# EAGLE design Module_T+H_02v (EAGLE 7.7.0)
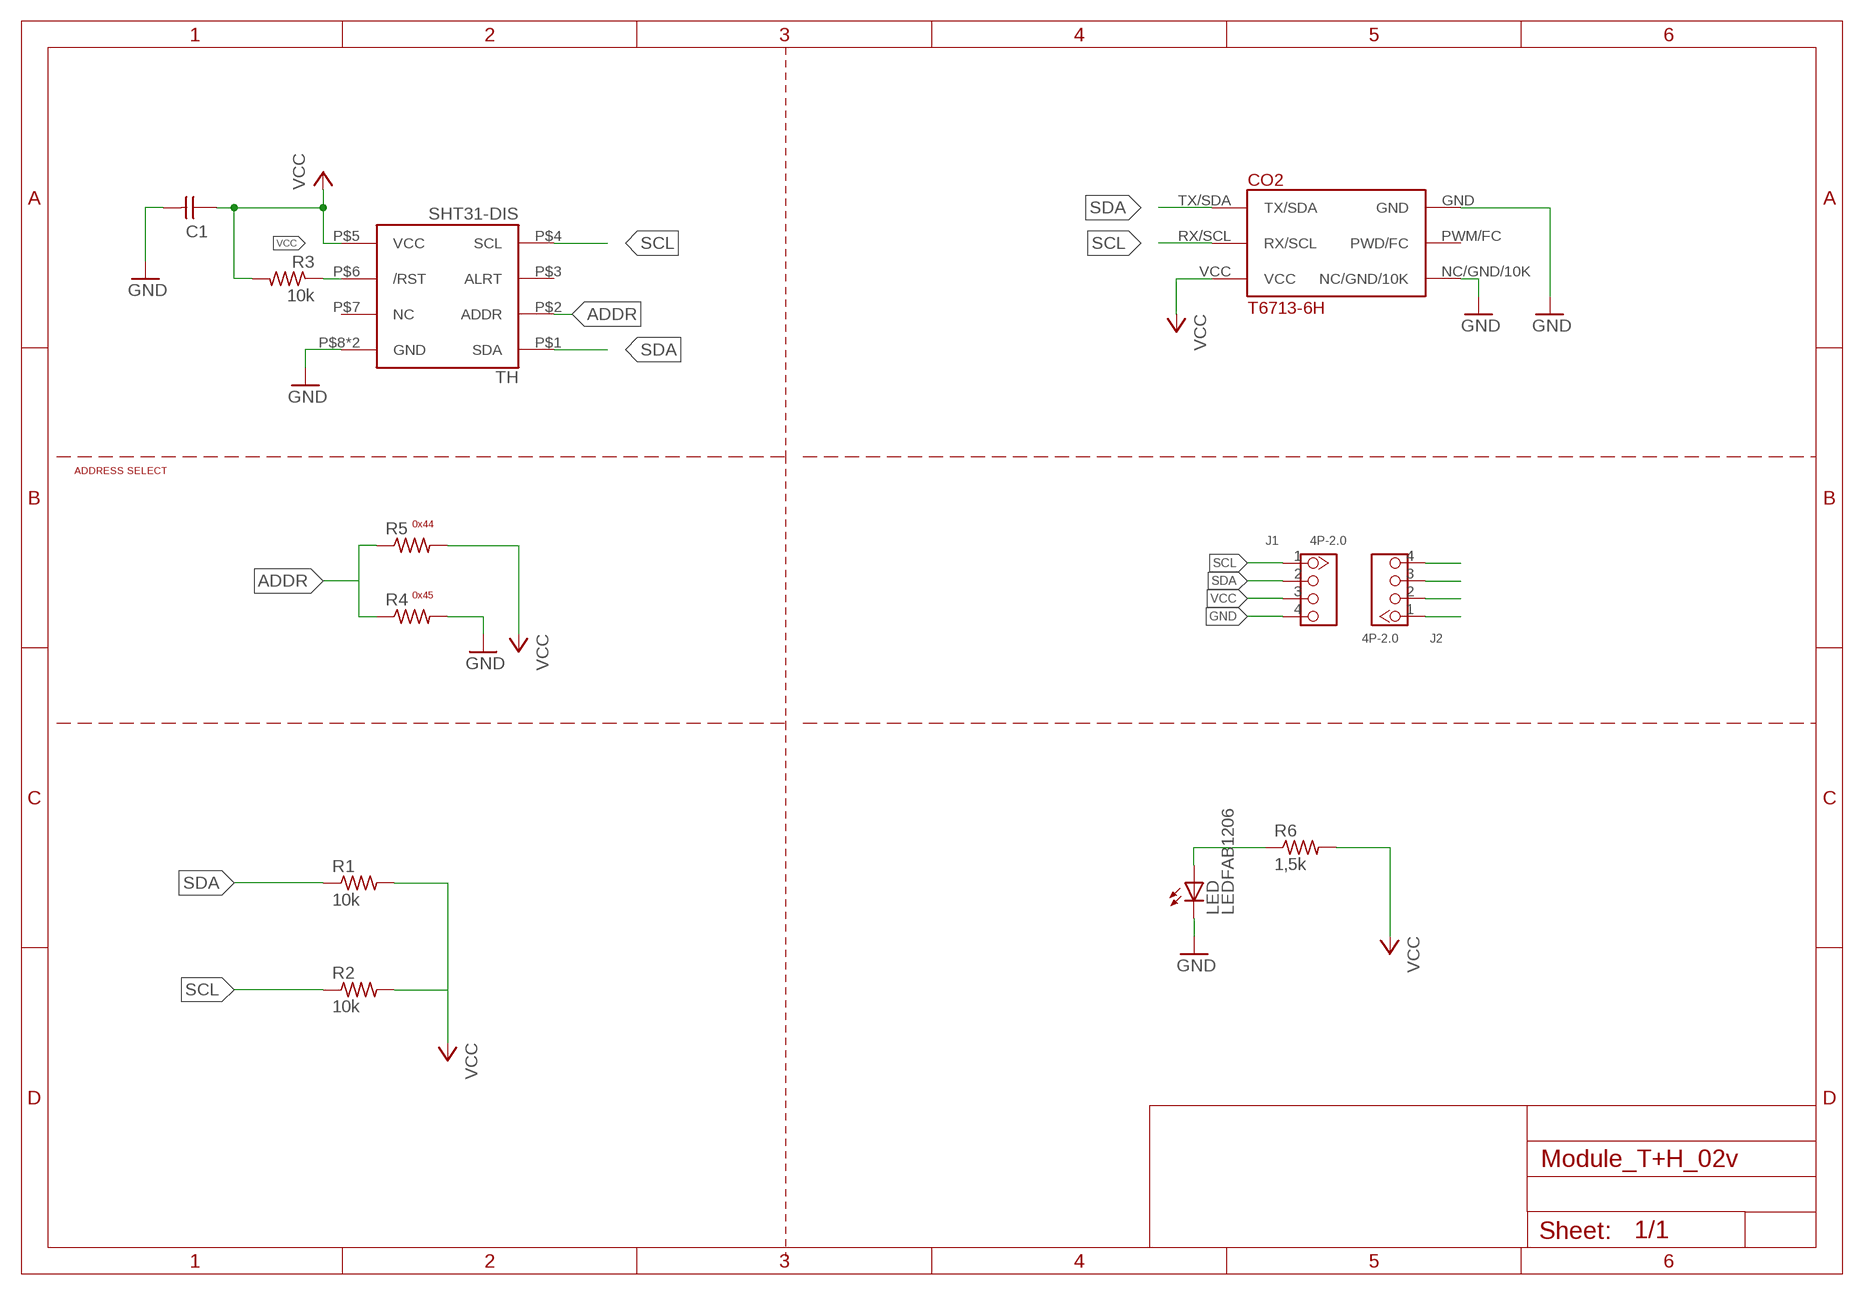
[diagram p0: schematic, sheet 1]

## Parts
C1  CAP-UNPOLARIZEDFAB  [C1206FAB]
CO2  T6713-6H  [PINS]
J1  4P-2.0  GROVE-CONNECTOR-DIP(4P-2.0)  [HW4-2.0]
J2  4P-2.0  GROVE-CONNECTOR-DIP(4P-2.0)  [HW4-2.0]
LED  LEDFAB1206  [LED1206FAB]
R1  10k  RES-US1206FAB  [R1206FAB]
R2  10k  RES-US1206FAB  [R1206FAB]
R3  10k  RES-US1206FAB  [R1206FAB]
R4  RES-US1206FAB  [R1206FAB]
R5  RES-US1206FAB  [R1206FAB]
R6  1,5k  RES-US1206FAB  [R1206FAB]
TH  SHT31-DIS  [SHT3X]

## Nets
ADDR: R4.1 R5.1 TH.P$2(ADDR)
GND: C1.2 CO2.GND CO2.NC/GND/10K J1.4 LED.2(C) R4.2 TH.P$8(GND) TH.PAD(GND)
N$1: LED.1(A) R6.1
N$10: J2.4
N$11: J2.3
N$12: J2.2
N$13: J2.1
RST: R3.1 TH.P$6(/RST)
SCL: CO2.RX/SCL J1.1 R2.1 TH.P$4(SCL)
SDA: CO2.TX/SDA J1.2 R1.1 TH.P$1(SDA)
VCC: C1.1 CO2.VCC J1.3 R1.2 R2.2 R3.2 R5.2 R6.2 TH.P$5(VCC)
Unconnected: CO2.PWM/FC(PWD/FC) TH.P$3(ALRT) TH.P$7(NC)

## Notes on the sheet
- ADDRESS SELECT
- 0x44
- 0x45

## Library data of the parts
C1 = fab_2:CAP-UNPOLARIZED
CO2 = T6713-6H:T6713-6H
J1 J2 = Seeed-OPL-Connector:GROVE-CONNECTOR-DIP(4P-2.0): 320110033
LED = fab_2:LED: LED
R1-R6 = fab:RES-US: Resistor (US Symbol) Variants with postfix FAB are widened to allow the routing of internal traces
TH = thomasb9511:SHT31-DIS

## Board
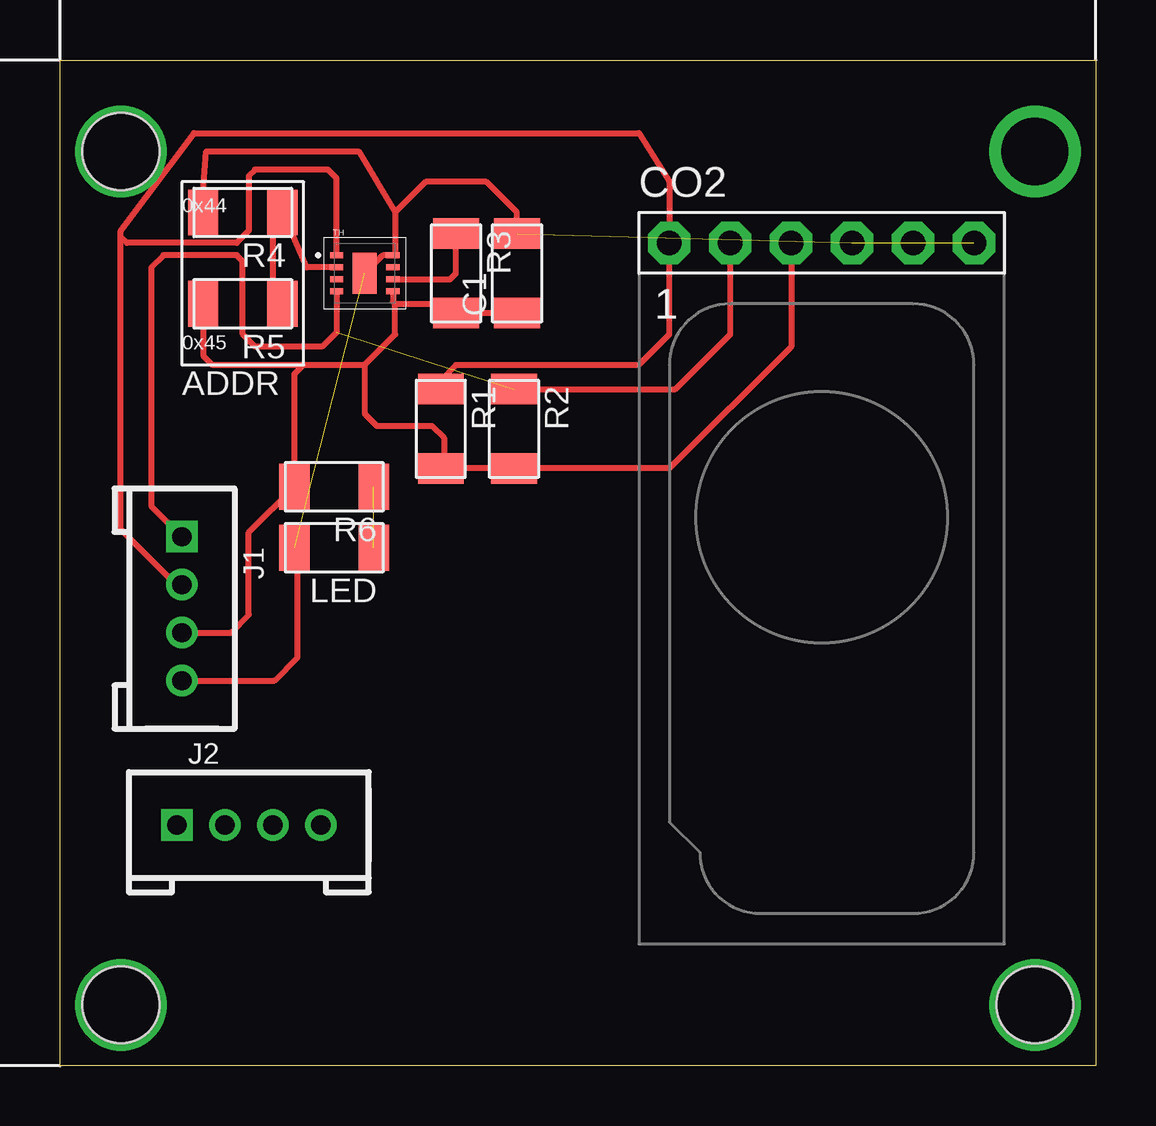
[diagram p1: board, top side]

Size 43.18 x 41.91 mm. Coordinates in mm from the lower left corner, seen from the top.
Outline: 0,0 0,41.91 43.18,41.91 43.18,0 0,0
Copper layers (1*16): Top 0.035mm / dielectric 1.5mm / Bottom 0.035mm
Design rules "default": minimum track width 10mil, minimum drill 24mil, track to track 8mil, track to pad 8mil, pad to pad 8mil, via to via 8mil, smd to smd 8mil, copper to edge 40mil, drill to drill 8mil, minimum pad ring 10mil, minimum via ring 8mil, stop-mask expansion 4mil, vias tented up to drill 0mil, thermal gap 10mil
Holes 3.2 mm at 2.54,38.1 2.54,2.54 40.64,2.54

### Footprints (pad centres in the part's own frame; a part is rotated, then mirrored left to right if it is on the bottom)
C1206FAB = smd 1.27 x 1.905: 1 -1.651,0; 2 1.651,0
PINS = drill 1.016 pad 1.778 octagon: GND 1.27,0; NC/GND/10K 6.35,0; PWM/FC 3.81,0; RX/SCL -3.81,0; TX/SDA -6.35,0; VCC -1.27,0
HW4-2.0 = drill 0.8 pad 1.27 square: 1 -3,0 | drill 0.8 pad 1.27: 2 -1,0; 3 1,0; 4 3,0
LED1206FAB = smd 1.27 x 1.905: 1 -1.651,0; 2 1.651,0
R1206FAB = smd 1.27 x 1.905: 1 -1.651,0; 2 1.651,0
SHT3X = smd 0.55 x 0.25: P$1 -1.175,0.75; P$2 -1.175,0.25; P$3 -1.175,-0.25; P$4 -1.175,-0.75; P$5 1.175,-0.75; P$6 1.175,-0.25; P$7 1.175,0.25; P$8 1.175,0.75 | smd 1 x 1.7: PAD 0,0

### Placement (x,y rotation side)
C1  19.05,33.02 90 top
CO2  31.75,34.29 0 top
J1  5.08,19.05 270 top
J2  7.87,10.03 0 top
LED  11.43,21.59 180 top
R1  15.88,26.54 270 top
R2  18.92,26.54 270 top
R3  16.51,33.02 270 top
R4  7.62,35.56 180 top
R5  7.62,31.75 180 top
R6  11.43,24.13 180 top
TH  12.7,33.02 0 top

### Tracks (layer width: path | path; a pad name or v marks a point on that pad's centre or on a via)
ADDR
  Top 0.254: R5.1 8.89,31.75 8.89,35.18 R4.1 10.29,33.27 TH.P$2
GND  (3 unrouted)
  Top 0.254: TH.PAD 13.45,33.77 TH.P$8 13.97,33.87 13.97,35.56 | C1.2 19.05,35.56 17.78,36.83 15.24,36.83 13.97,35.56 | R4.2 5.97,36.45 6.1,38.1 12.45,38.1 13.97,35.56 | J1.4 8.94,16.05 9.91,17.02 9.91,21.46 LED.2
N$1  (1 unrouted)
N$2  (via drill 2.8 pad 0.3)
  other vias: 2.54,38.1
N$3  (via drill 2.8 pad 0.3)
  other vias: 40.64,38.1
N$4  (via drill 2.8 pad 0.3)
  other vias: 2.54,2.54
N$5  (via drill 2.8 pad 0.3)
  other vias: 40.64,2.54
RST
  Top 0.254: TH.P$6 16.26,32.77 16.51,33.02 R3.1
SCL  (1 unrouted)
  Top 0.254: R2.1 25.65,28.19 27.94,30.48 CO2.RX/SCL | TH.P$4 11.53,30.57 10.92,29.97 8.13,29.97 7.62,30.48 7.62,33.53 7.37,33.78 4.32,33.78 3.81,33.27 3.81,23.32 J1.1
SDA
  Top 0.254: R1.1 15.88,28.57 16.51,29.21 24.13,29.21 25.4,30.48 CO2.TX/SDA 25.4,36.83 24.13,38.86 5.59,38.86 2.54,34.8 2.54,34.54 | J1.2 4.84,20.05 2.54,22.35 2.54,34.54 | TH.P$1 11.53,36.99 11.18,37.34 8.13,37.34 7.87,37.08 7.87,34.8 7.37,34.29 2.79,34.29 2.54,34.54
VCC
  Top 0.254: TH.P$5 13.88,31.84 13.97,31.75 | 13.97,31.75 16.13,31.75 R3.2 C1.1 | R5.2 5.97,29.59 6.35,29.21 10.16,29.21 | 10.16,29.21 12.7,29.21 | 12.7,29.21 13.97,30.48 13.97,31.75 | 12.7,29.21 12.7,27.18 13.21,26.67 15.49,26.67 16,26.16 16,25.02 R1.2 18.29,24.89 R2.2 25.4,24.89 30.48,29.97 CO2.VCC | 10.16,29.21 9.78,28.83 R6.2 7.87,22.23 7.87,18.8 7.13,18.05 J1.3

### Text on the board
tPlace: 0x44 | 0x45 | ADDR